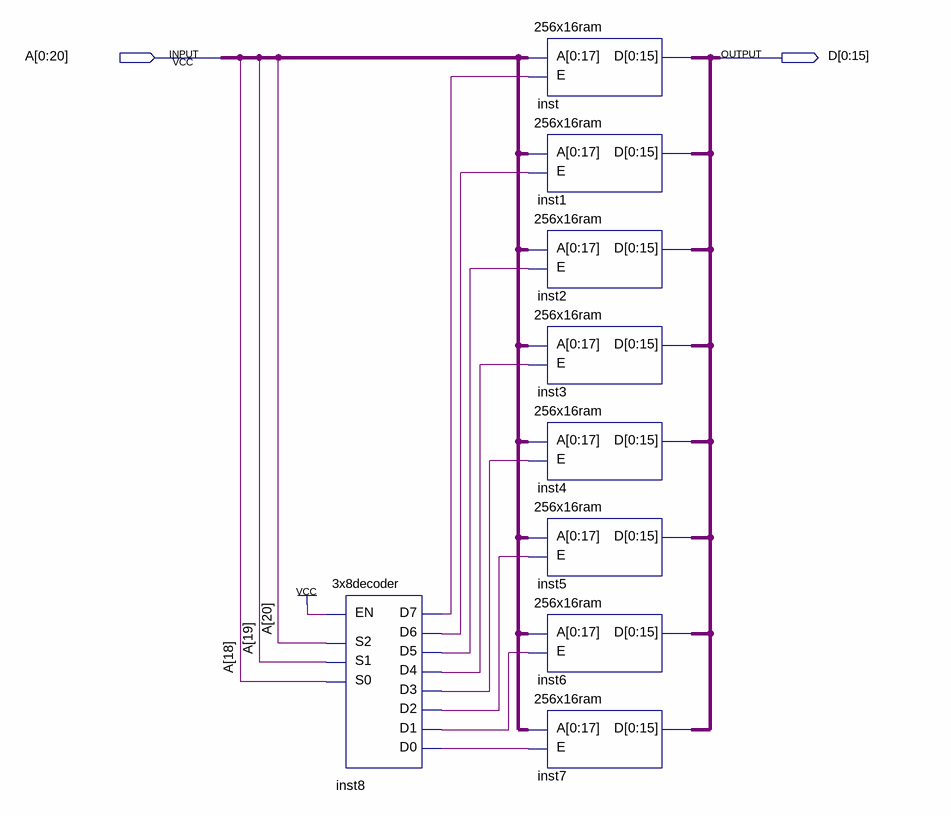
[diagram p0: schematic sheet]
// Quartus schematic hw12p5a.bdf as structural Verilog: 9 symbols, 2 pins
module hw12p5a (
  input  [0:20] A,
  output [0:15] D
);

  wire inst8_d0, inst8_d1, inst8_d2, inst8_d3, inst8_d4, inst8_d5, inst8_d6, inst8_d7;

  \3x8decoder  inst8 (
    .S2(A[20]), .S1(A[19]), .S0(A[18]), .EN(1'b1), .D7(inst8_d7), .D6(inst8_d6), .D5(inst8_d5),
    .D4(inst8_d4), .D3(inst8_d3), .D2(inst8_d2), .D1(inst8_d1), .D0(inst8_d0));
  \256x16ram  inst (.E(inst8_d7), .A(A), .D(D));
  \256x16ram  inst1 (.E(inst8_d6), .A(A), .D(D));
  \256x16ram  inst2 (.E(inst8_d5), .A(A), .D(D));
  \256x16ram  inst3 (.E(inst8_d4), .A(A), .D(D));
  \256x16ram  inst4 (.E(inst8_d3), .A(A), .D(D));
  \256x16ram  inst5 (.E(inst8_d2), .A(A), .D(D));
  \256x16ram  inst6 (.E(inst8_d1), .A(A), .D(D));
  \256x16ram  inst7 (.E(inst8_d0), .A(A), .D(D));
endmodule
